# EAGLE design pico-featherwing (EAGLE 9.6.2)
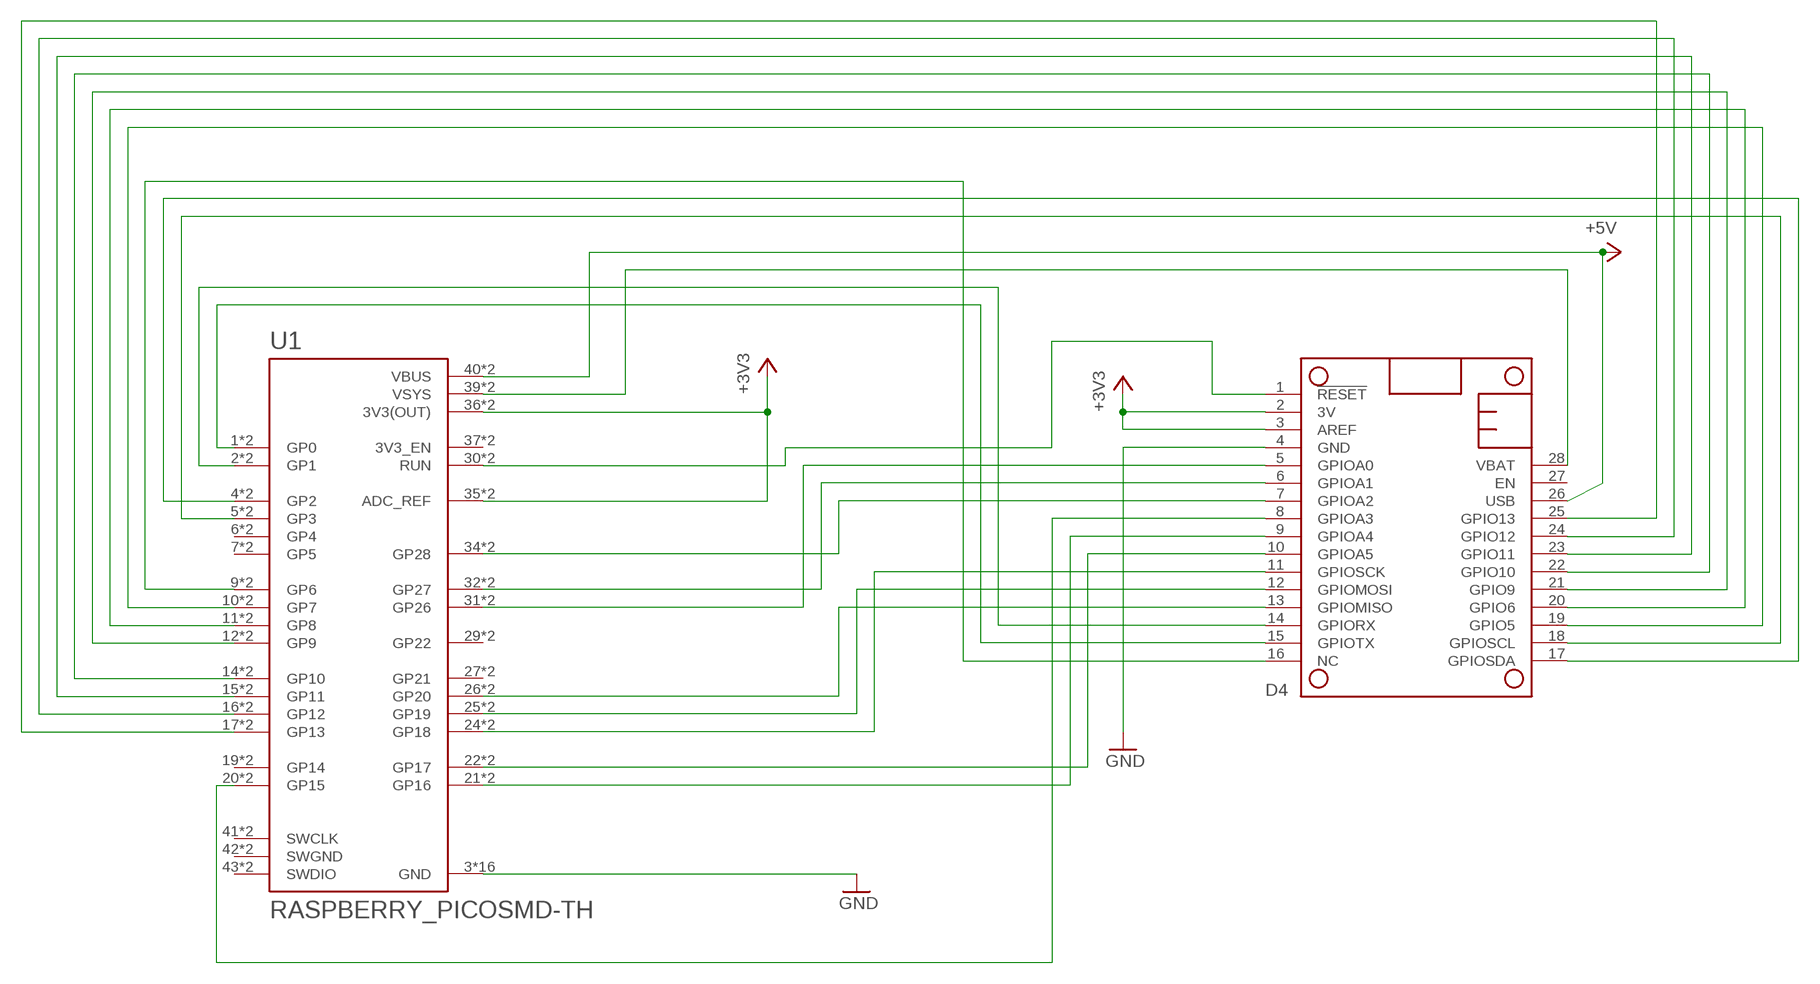
[diagram p0: schematic, sheet 1]

## Parts
MS1  MICROBUILDER_FEATHERWING_NODIM  [MICROBUILDER_FEATHERWING_DIM]
U1  RASPBERRY_PICOSMD-TH  [PICO-PKG]

## Nets
+3V3 [Power]: MS1.2(3V) MS1.3(AREF) U1.35(ADC_REF) U1.36(3V3(OUT)) U1.P$35(ADC_REF) U1.P$36(3V3(OUT))
D4: MS1.19(GPIO5) U1.10(GP7) U1.P$10(GP7)
GND: MS1.4(GND) U1.3(GND) U1.8(GND) U1.13(GND) U1.18(GND) U1.23(GND) U1.28(GND) U1.33(GND) U1.38(GND) U1.P$3(GND) U1.P$8(GND) U1.P$13(GND) U1.P$18(GND) U1.P$23(GND) U1.P$28(GND) U1.P$33(GND) U1.P$38(GND)
N$1: MS1.15(GPIOTX) U1.1(GP0) U1.P$1(GP0)
N$2: MS1.14(GPIORX) U1.2(GP1) U1.P$2(GP1)
N$3: MS1.20(GPIO6) U1.11(GP8) U1.P$11(GP8)
N$4: MS1.21(GPIO9) U1.12(GP9) U1.P$12(GP9)
N$5: MS1.22(GPIO10) U1.14(GP10) U1.P$14(GP10)
N$6: MS1.23(GPIO11) U1.15(GP11) U1.P$15(GP11)
N$7: MS1.24(GPIO12) U1.16(GP12) U1.P$16(GP12)
N$8: MS1.25(GPIO13) U1.17(GP13) U1.P$17(GP13)
N$9: MS1.16(NC) U1.9(GP6) U1.P$9(GP6)
N$10: MS1.13(GPIOMISO) U1.26(GP20) U1.P$26(GP20)
N$11: MS1.12(GPIOMOSI) U1.25(GP19) U1.P$25(GP19)
N$12: MS1.11(GPIOSCK) U1.24(GP18) U1.P$24(GP18)
N$13: MS1.5(GPIOA0) U1.31(GP26) U1.P$31(GP26)
N$14: MS1.6(GPIOA1) U1.32(GP27) U1.P$32(GP27)
N$15: MS1.7(GPIOA2) U1.34(GP28) U1.P$34(GP28)
N$16: MS1.1(!RESET) U1.30(RUN) U1.P$30(RUN)
N$17: MS1.8(GPIOA3) U1.20(GP15) U1.P$20(GP15)
N$18: MS1.9(GPIOA4) U1.21(GP16) U1.P$21(GP16)
N$19: MS1.10(GPIOA5) U1.22(GP17) U1.P$22(GP17)
SCL: MS1.18(GPIOSCL) U1.5(GP3) U1.P$5(GP3)
SDA: MS1.17(GPIOSDA) U1.4(GP2) U1.P$4(GP2)
USB: MS1.26(USB) U1.40(VBUS) U1.P$40(VBUS) ; supply symbol labelled +5V
VBAT [Power]: MS1.28(VBAT) U1.39(VSYS) U1.P$39(VSYS)
Unconnected: MS1.27(EN) U1.6(GP4) U1.7(GP5) U1.19(GP14) U1.27(GP21) U1.29(GP22) U1.37(3V3_EN) U1.41(SWCLK) U1.43(SWDIO) U1.P$6(GP4) U1.P$7(GP5) U1.P$19(GP14) U1.P$27(GP21) U1.P$29(GP22) U1.P$37(3V3_EN) U1.P$41(SWCLK) U1.P$43(SWDIO)

## Power pins joined to a net without a drawn wire
GND: U1.42(SWGND) U1.P$42(SWGND)

## Library data of the parts
MS1 = TripleWing:MICROBUILDER_FEATHERWING
U1 = RpiPico:RASPBERRY_PICO: Raspberry Pi Pico

## Net classes
1 Power: width 1.27 mm

## Board
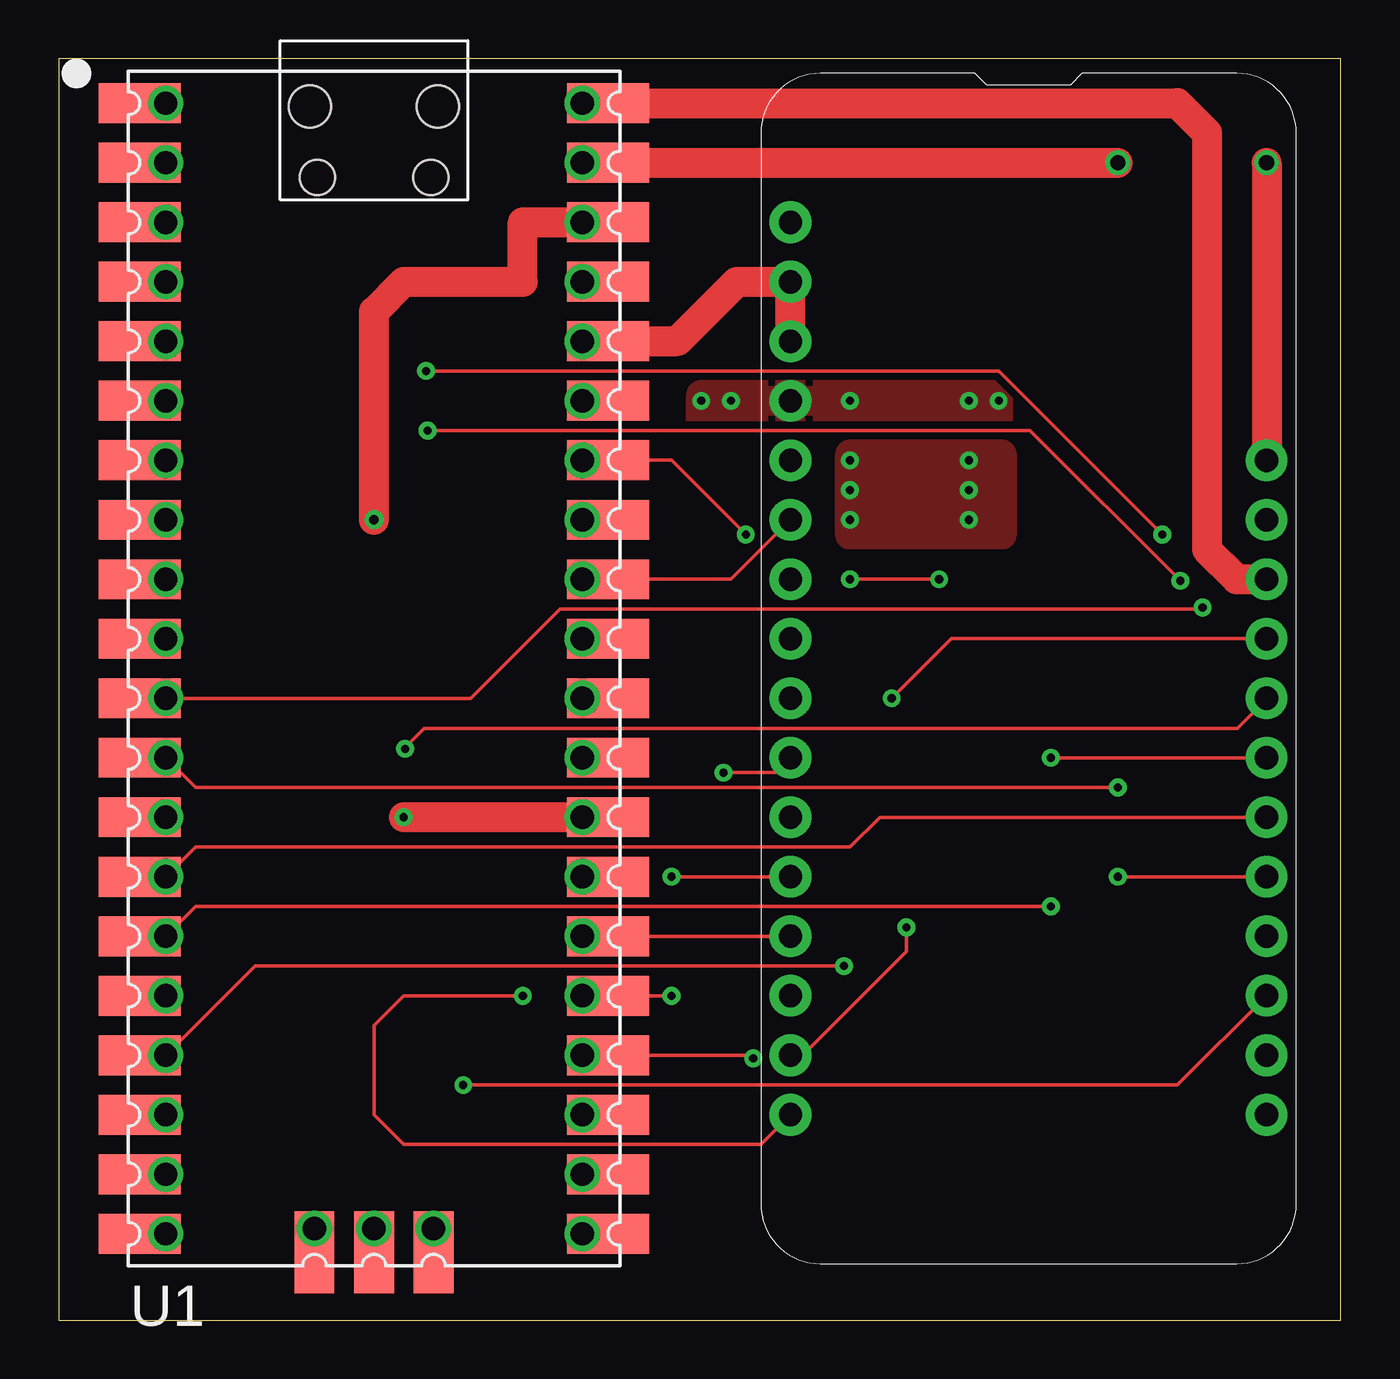
[diagram p1: board, top side]
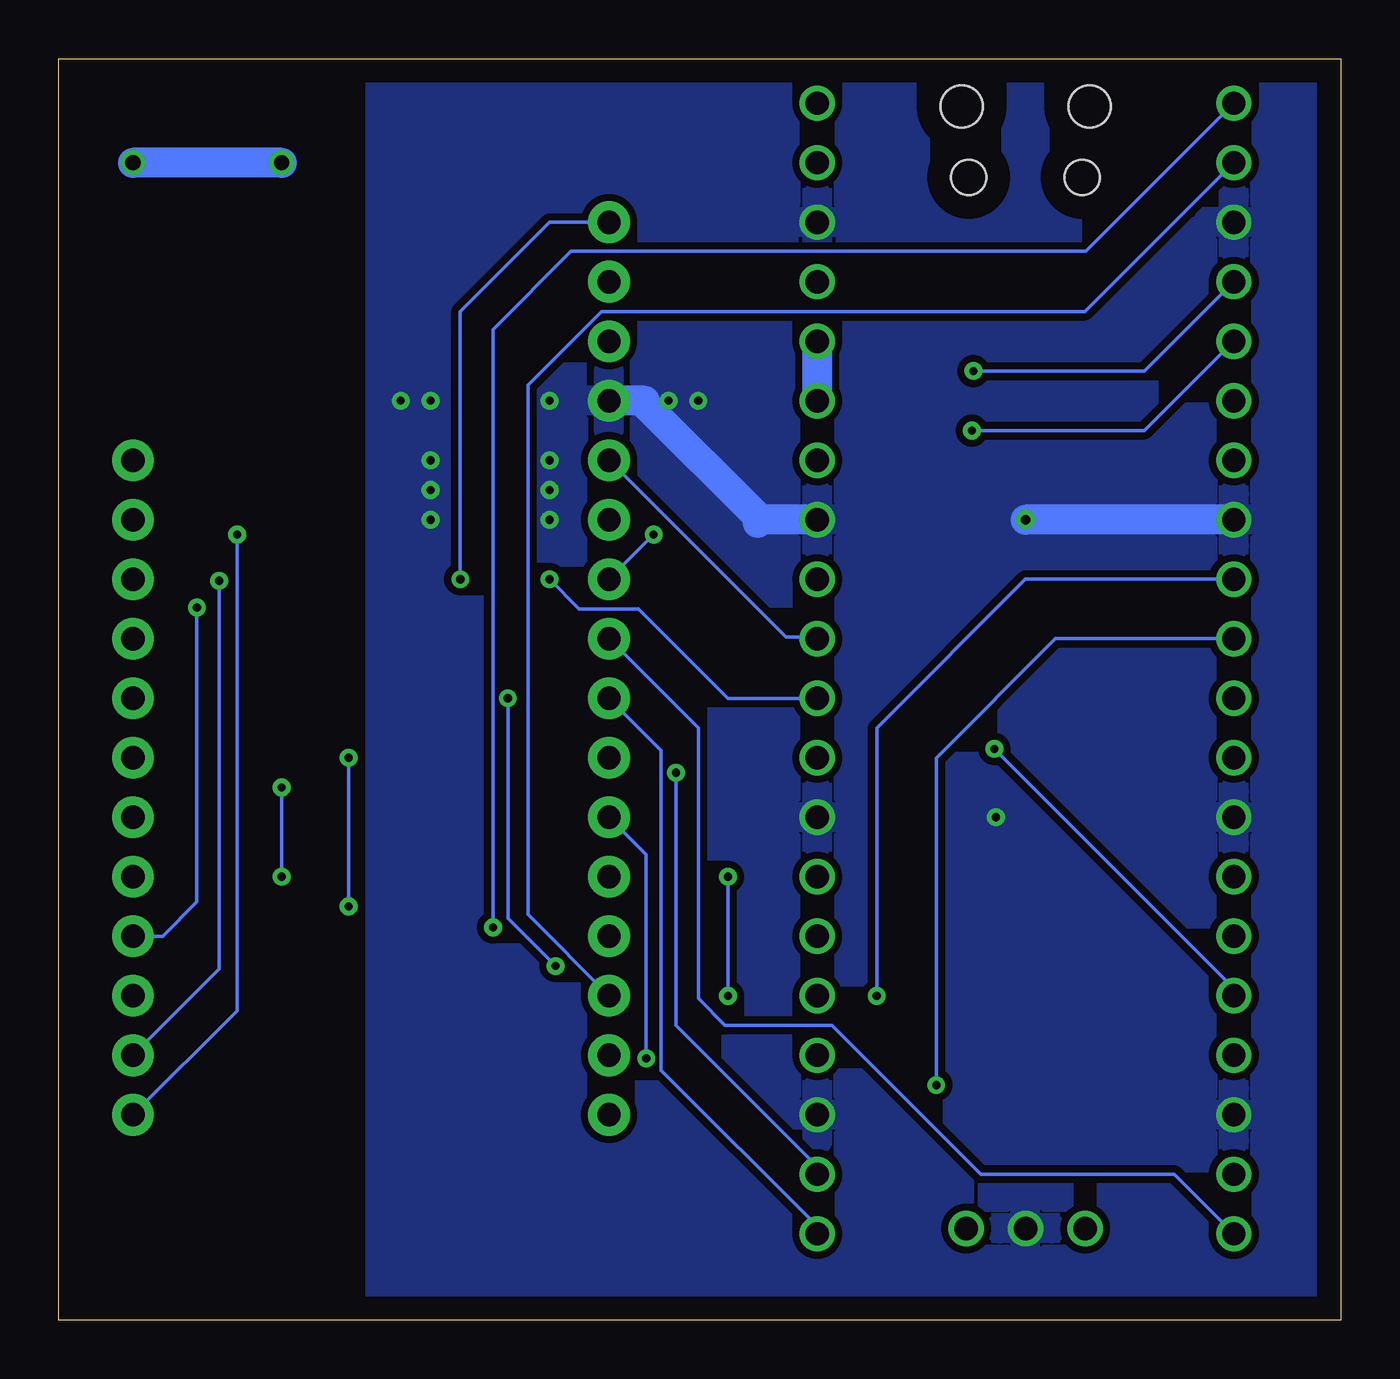
[diagram p2: board, bottom side, seen from below]

Size 54.74 x 53.85 mm. Coordinates in mm from the lower left corner, seen from the top.
Outline: 0,0 54.74,0 54.74,53.85 0,53.85 0,0
Copper layers (1*16): Top 0.035mm / dielectric 1.5mm / Bottom 0.035mm
Design rules "default": minimum track width 6mil, minimum drill 0.35mm, track to track 6mil, track to pad 6mil, pad to pad 6mil, via to via 6mil, smd to smd 6mil, copper to edge 40mil, drill to drill 6mil, minimum pad ring 10mil, minimum via ring 8mil, stop-mask expansion 4mil, vias tented up to drill 0mil, thermal gap 10mil

### Footprints (pad centres in the part's own frame; a part is rotated, then mirrored left to right if it is on the bottom)
MICROBUILDER_FEATHERWING_DIM = drill 1 pad 1.778: 1 6.35,1.27; 2 8.89,1.27; 3 11.43,1.27; 4 13.97,1.27; 5 16.51,1.27; 6 19.05,1.27; 7 21.59,1.27; 8 24.13,1.27; 9 26.67,1.27; 10 29.21,1.27; 11 31.75,1.27; 12 34.29,1.27; 13 36.83,1.27; 14 39.37,1.27; 15 41.91,1.27; 16 44.45,1.27; 17 44.45,21.59; 18 41.91,21.59; 19 39.37,21.59; 20 36.83,21.59; 21 34.29,21.59; 22 31.75,21.59; 23 29.21,21.59; 24 26.67,21.59; 25 24.13,21.59; 26 21.59,21.59; 27 19.05,21.59; 28 16.51,21.59
PICO-PKG = drill 1: 1 -8.89,24.13; 2 -8.89,21.59; 3 -8.89,19.05; 4 -8.89,16.51; 5 -8.89,13.97; 6 -8.89,11.43; 7 -8.89,8.89; 8 -8.89,6.35; 9 -8.89,3.81; 10 -8.89,1.27; 11 -8.89,-1.27; 12 -8.89,-3.81; 13 -8.89,-6.35; 14 -8.89,-8.89; 15 -8.89,-11.43; 16 -8.89,-13.97; 17 -8.89,-16.51; 18 -8.89,-19.05; 19 -8.89,-21.59; 20 -8.89,-24.13; 21 8.89,-24.13; 22 8.89,-21.59; 23 8.89,-19.05; 24 8.89,-16.51; 25 8.89,-13.97; 26 8.89,-11.43; 27 8.89,-8.89; 28 8.89,-6.35; 29 8.89,-3.81; 30 8.89,-1.27; 31 8.89,1.27; 32 8.89,3.81; 33 8.89,6.35; 34 8.89,8.89; 35 8.89,11.43; 36 8.89,13.97; 37 8.89,16.51; 38 8.89,19.05; 39 8.89,21.59; 40 8.89,24.13; 41 -2.54,-23.9; 42 0,-23.9; 43 2.54,-23.9 | smd 3.5 x 1.7: P$1 -10,24.13; P$2 -10,21.59; P$3 -10,19.05; P$4 -10,16.51; P$5 -10,13.97; P$6 -10,11.43; P$7 -10,8.89; P$8 -10,6.35; P$9 -10,3.81; P$10 -10,1.27; P$11 -10,-1.27; P$12 -10,-3.81; P$13 -10,-6.35; P$14 -10,-8.89; P$15 -10,-11.43; P$16 -10,-13.97; P$17 -10,-16.51; P$18 -10,-19.05; P$19 -10,-21.59; P$20 -10,-24.13; P$21 10,-24.13; P$22 10,-21.59; P$23 10,-19.05; P$24 10,-16.51; P$25 10,-13.97; P$26 10,-11.43; P$27 10,-8.89; P$28 10,-6.35; P$29 10,-3.81; P$30 10,-1.27; P$31 10,1.27; P$32 10,3.81; P$33 10,6.35; P$34 10,8.89; P$35 10,11.43; P$36 10,13.97; P$37 10,16.51; P$38 10,19.05; P$39 10,21.59; P$40 10,24.13 | smd 1.7 x 3.5: P$41 -2.54,-24.925; P$42 0,-24.925; P$43 2.54,-24.925 | hole 1.8: -2.725,24; 2.725,24 | hole 1.5: -2.425,20.97; 2.425,20.97

### Placement (x,y rotation side)
MS1  29.97,53.21 270 top
U1  13.46,27.81 0 top

### Tracks (layer width: path | path; a pad name or v marks a point on that pad's centre or on a via)
+3V3
  Top 1.27: MS1.3 MS1.2 28.95,44.32 26.43,41.8 23.48,41.8 U1.P$36 U1.36 | U1.P$35 U1.35
  Bottom 1.27: U1.35 U1.36
D4  (via drill 0.35)
  Top 0.152: U1.P$10 U1.10 | MS1.19 47.75,10.03 v17.27,10.03
  Bottom 0.152: v17.27,10.03 17.27,24 12.19,29.08 U1.10
GND  (via drill 0.35, 0.4)
  Top 0.152: U1.18 U1.P$18 | U1.13 U1.P$13 | U1.8 U1.P$8 | U1.28 U1.P$28 | U1.3 U1.P$3 | U1.33 U1.P$33 | U1.38 U1.P$38 | U1.P$42 U1.42 | U1.P$23 23.3,8.76 22.99,9.08 22.67,9.08 U1.23
  Top 1.27: v13.46,34.16 13.46,43.05 14.73,44.32 19.81,44.32 19.81,46.86 U1.38 | U1.P$28 v14.73,21.46
  Bottom 1.27: U1.33 24.77,34.16 | 24.77,34.16 24.89,34.04 | 24.77,34.16 29.72,39.12 29.72,39.24 MS1.4 | U1.8 v13.46,34.16
  other vias: 33.78,39.24 28.7,39.24 38.86,39.24 38.86,36.7 38.86,35.43 38.86,34.16 33.78,36.7 33.78,35.43 33.78,34.16 27.43,39.24 40.13,39.24
  pour Bottom (isolate 0.305): 0.76,53.21 41.02,53.21 41.02,0.51 0.76,0.51
  pour Top (isolate 0.305): 40.26,37.97 27.43,37.97 27.43,39.5 40.26,39.5
  pour Top (isolate 0.305): 40.26,33.53 33.78,33.53 33.78,36.96 40.26,36.96
N$1  (via drill 0.35)
  Top 0.152: U1.P$1 U1.1 | MS1.15 31.75,11.3 36.2,15.75 v36.2,16.76
  Bottom 0.152: U1.1 10.9,45.62 32.85,45.62 36.2,42.28 v36.2,16.76
N$2
  Top 0.152: U1.P$2 U1.2
  Bottom 0.152: U1.2 10.92,43.05 31.55,43.05 34.71,39.9 34.71,17.31 MS1.14
N$3  (via drill 0.35)
  Top 0.152: U1.P$11 U1.11 17.59,26.54 21.4,30.35 48.77,30.35 v48.83,30.42
  Bottom 0.152: v48.83,30.42 48.83,17.84 50.29,16.38 MS1.20
N$4  (via drill 0.35)
  Top 0.152: U1.P$12 U1.12 5.84,22.73 v45.21,22.73 | v45.21,18.92 MS1.21
  Bottom 0.152: v45.21,18.92 v45.21,22.73
N$5
  Top 0.152: U1.P$14 U1.14 5.84,20.19 33.78,20.19 35.05,21.46 MS1.22
N$6  (via drill 0.35)
  Top 0.152: U1.P$15 U1.15 5.84,17.65 v42.35,17.65 | v42.35,24 MS1.23
  Bottom 0.152: v42.35,17.65 v42.35,24
N$7  (via drill 0.35)
  Top 0.152: U1.P$16 U1.16 | v14.8,24.38 14.76,24.42 15.6,25.25 50.32,25.25 51.56,26.49 MS1.24
  Bottom 0.152: v14.8,24.38 4.57,14.16 U1.16
N$8  (via drill 0.35)
  Top 0.152: U1.P$17 U1.17 8.38,15.11 v33.53,15.11 | v35.56,26.54 38.1,29.08 MS1.25
  Bottom 0.152: v35.56,26.54 35.56,17.15 v33.53,15.11
N$9  (via drill 0.35)
  Top 0.152: MS1.16 29.97,7.49 14.73,7.49 13.46,8.76 13.46,12.57 14.73,13.84 v19.81,13.84 | U1.P$9 U1.9
  Bottom 0.152: v19.81,13.84 19.81,25.27 13.46,31.62 U1.9
N$10
  Top 0.152: U1.26 U1.P$26 MS1.13
N$11  (via drill 0.35)
  Top 0.152: U1.25 U1.P$25 v26.16,13.84 | v26.16,18.92 MS1.12
  Bottom 0.152: v26.16,13.84 v26.16,18.92
N$12  (via drill 0.35)
  Top 0.152: U1.24 U1.P$24 29.53,11.3 v29.66,11.18
  Bottom 0.152: MS1.11 29.66,19.88 v29.66,11.18
N$13
  Top 0.152: U1.P$31 U1.31
  Bottom 0.152: MS1.5 23.69,29.15 22.42,29.15 U1.31
N$14
  Top 0.152: U1.32 U1.P$32 28.7,31.62 MS1.6
N$15  (via drill 0.35)
  Top 0.152: U1.34 U1.P$34 26.16,36.7 v29.34,33.53
  Bottom 0.152: MS1.7 v29.34,33.53
N$16  (via drill 0.35)
  Top 0.152: v33.78,31.62 v37.59,31.62
  Top 1.27: U1.P$30 U1.30
  Bottom 0.152: v33.78,31.62 32.51,30.35 29.97,30.35 26.16,26.54 U1.30 | v37.59,31.62 37.59,43.05 33.78,46.86 MS1.1
N$17
  Top 0.152: U1.P$20 U1.20
  Bottom 0.152: U1.20 7.11,6.22 15.37,6.22 21.72,12.57 26.28,12.57 27.43,13.72 27.43,25.27 MS1.8
N$18
  Top 0.152: U1.P$21 U1.21
  Bottom 0.152: MS1.9 29.02,24.32 29.02,10.67 22.35,4 U1.21
N$19  (via drill 0.35)
  Top 0.152: U1.P$22 U1.22 | MS1.10 30.61,23.37 v28.38,23.37
  Bottom 0.152: v28.38,23.37 28.38,12.57 22.35,6.54 U1.22
SCL  (via drill 0.35)
  Top 0.152: U1.P$5 U1.5 | v47.88,31.56 41.47,37.97 v15.75,37.97
  Bottom 0.152: MS1.18 47.88,14.99 v47.88,31.56 | v15.75,37.97 8.38,37.97 U1.5
SDA  (via drill 0.35)
  Top 0.152: U1.P$4 U1.4 | v47.12,33.53 40.13,40.51 v15.68,40.51
  Bottom 0.152: MS1.17 47.12,13.21 v47.12,33.53 | v15.68,40.51 8.38,40.51 U1.4
USB
  Top 1.27: MS1.26 50.29,31.62 49.02,32.89 49.02,50.67 47.75,51.94 U1.40 U1.P$40
VBAT  (via drill 0.65)
  Top 1.27: v45.21,49.4 U1.P$39 U1.39 | v51.56,49.4 MS1.28
  Bottom 1.27: v45.21,49.4 v51.56,49.4